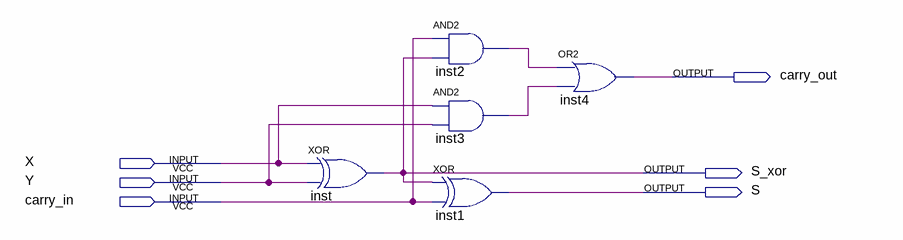
[diagram p0: schematic sheet]
// Quartus schematic full-adder.bdf as structural Verilog: 5 symbols, 6 pins
module \full-adder  (
  input  X,
  input  Y,
  input  carry_in,
  output carry_out,
  output S_xor,
  output S
);

  wire inst2_out, inst3_out;

  xor inst (S_xor, X, Y);
  and inst2 (inst2_out, carry_in, S_xor);
  and inst3 (inst3_out, X, Y);
  xor inst1 (S, S_xor, carry_in);
  or inst4 (carry_out, inst2_out, inst3_out);
endmodule
